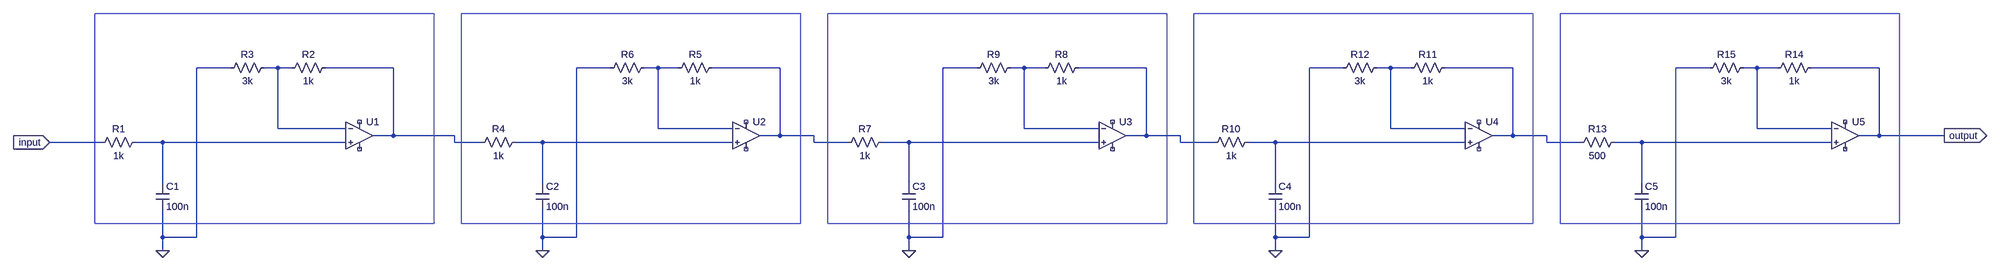
[diagram p0: schematic levy-delay.asc]
levy-delay.asc, the LTspice schematic file:
Version 4
SHEET 1 2968 1204
WIRE -1296 752 -1376 752
WIRE -1184 752 -1216 752
WIRE -1152 752 -1184 752
WIRE -912 752 -1072 752
WIRE -400 752 -480 752
WIRE -288 752 -320 752
WIRE -240 752 -288 752
WIRE 0 752 -160 752
WIRE 464 752 384 752
WIRE 576 752 544 752
WIRE 624 752 576 752
WIRE 864 752 704 752
WIRE 1328 752 1248 752
WIRE 1440 752 1408 752
WIRE 1488 752 1440 752
WIRE 1728 752 1568 752
WIRE 2192 752 2112 752
WIRE 2304 752 2272 752
WIRE 2352 752 2304 752
WIRE 2592 752 2432 752
WIRE -1184 896 -1184 752
WIRE -1024 896 -1184 896
WIRE -288 896 -288 752
WIRE -112 896 -288 896
WIRE 576 896 576 752
WIRE 752 896 576 896
WIRE 1440 896 1440 752
WIRE 1616 896 1440 896
WIRE 2304 896 2304 752
WIRE 2480 896 2304 896
WIRE -912 912 -912 752
WIRE -912 912 -960 912
WIRE -768 912 -912 912
WIRE 0 912 0 752
WIRE 0 912 -48 912
WIRE 80 912 0 912
WIRE 864 912 864 752
WIRE 864 912 816 912
WIRE 944 912 864 912
WIRE 1728 912 1728 752
WIRE 1728 912 1680 912
WIRE 1808 912 1728 912
WIRE 2592 912 2592 752
WIRE 2592 912 2544 912
WIRE 2832 912 2592 912
WIRE -1600 928 -1776 928
WIRE -1456 928 -1520 928
WIRE -1024 928 -1456 928
WIRE -768 928 -768 912
WIRE -704 928 -768 928
WIRE -560 928 -624 928
WIRE -112 928 -560 928
WIRE 80 928 80 912
WIRE 160 928 80 928
WIRE 304 928 240 928
WIRE 752 928 304 928
WIRE 944 928 944 912
WIRE 1024 928 944 928
WIRE 1168 928 1104 928
WIRE 1616 928 1168 928
WIRE 1808 928 1808 912
WIRE 1888 928 1808 928
WIRE 2032 928 1968 928
WIRE 2480 928 2032 928
WIRE -1456 1024 -1456 928
WIRE -560 1024 -560 928
WIRE 304 1024 304 928
WIRE 1168 1024 1168 928
WIRE 2032 1024 2032 928
WIRE -1456 1152 -1456 1088
WIRE -1376 1152 -1376 752
WIRE -1376 1152 -1456 1152
WIRE -560 1152 -560 1088
WIRE -480 1152 -480 752
WIRE -480 1152 -560 1152
WIRE 304 1152 304 1088
WIRE 384 1152 384 752
WIRE 384 1152 304 1152
WIRE 1168 1152 1168 1088
WIRE 1248 1152 1248 752
WIRE 1248 1152 1168 1152
WIRE 2032 1152 2032 1088
WIRE 2112 1152 2112 752
WIRE 2112 1152 2032 1152
WIRE -1456 1184 -1456 1152
WIRE -560 1184 -560 1152
WIRE 304 1184 304 1152
WIRE 1168 1184 1168 1152
WIRE 2032 1184 2032 1152
FLAG -1456 1184 0
FLAG -560 1184 0
FLAG 304 1184 0
FLAG 1168 1184 0
FLAG 2032 1184 0
FLAG -1776 928 input
IOPIN -1776 928 In
FLAG 2832 912 output
IOPIN 2832 912 Out
SYMBOL res -1504 912 R90
WINDOW 0 0 56 VBottom 2
WINDOW 3 32 56 VTop 2
SYMATTR InstName R1
SYMATTR Value 1k
SYMATTR SpiceLine tol=1 pwr=0.1
SYMBOL cap -1472 1024 R0
SYMATTR InstName C1
SYMATTR Value 100n
SYMBOL res -1056 736 R90
WINDOW 0 0 56 VBottom 2
WINDOW 3 32 56 VTop 2
SYMATTR InstName R2
SYMATTR Value 1k
SYMBOL res -1200 736 R90
WINDOW 0 0 56 VBottom 2
WINDOW 3 32 56 VTop 2
SYMATTR InstName R3
SYMATTR Value 3k
SYMBOL OpAmps\\UniversalOpAmp1 -992 912 R0
SYMATTR InstName U1
SYMBOL res -608 912 R90
WINDOW 0 0 56 VBottom 2
WINDOW 3 32 56 VTop 2
SYMATTR InstName R4
SYMATTR Value 1k
SYMATTR SpiceLine tol=1 pwr=0.1
SYMBOL cap -576 1024 R0
SYMATTR InstName C2
SYMATTR Value 100n
SYMBOL res -144 736 R90
WINDOW 0 0 56 VBottom 2
WINDOW 3 32 56 VTop 2
SYMATTR InstName R5
SYMATTR Value 1k
SYMBOL res -304 736 R90
WINDOW 0 0 56 VBottom 2
WINDOW 3 32 56 VTop 2
SYMATTR InstName R6
SYMATTR Value 3k
SYMBOL OpAmps\\UniversalOpAmp1 -80 912 R0
SYMATTR InstName U2
SYMBOL res 256 912 R90
WINDOW 0 0 56 VBottom 2
WINDOW 3 32 56 VTop 2
SYMATTR InstName R7
SYMATTR Value 1k
SYMATTR SpiceLine tol=1 pwr=0.1
SYMBOL cap 288 1024 R0
SYMATTR InstName C3
SYMATTR Value 100n
SYMBOL res 720 736 R90
WINDOW 0 0 56 VBottom 2
WINDOW 3 32 56 VTop 2
SYMATTR InstName R8
SYMATTR Value 1k
SYMBOL res 560 736 R90
WINDOW 0 0 56 VBottom 2
WINDOW 3 32 56 VTop 2
SYMATTR InstName R9
SYMATTR Value 3k
SYMBOL OpAmps\\UniversalOpAmp1 784 912 R0
SYMATTR InstName U3
SYMBOL res 1120 912 R90
WINDOW 0 0 56 VBottom 2
WINDOW 3 32 56 VTop 2
SYMATTR InstName R10
SYMATTR Value 1k
SYMATTR SpiceLine tol=1 pwr=0.1
SYMBOL cap 1152 1024 R0
SYMATTR InstName C4
SYMATTR Value 100n
SYMBOL res 1584 736 R90
WINDOW 0 0 56 VBottom 2
WINDOW 3 32 56 VTop 2
SYMATTR InstName R11
SYMATTR Value 1k
SYMBOL res 1424 736 R90
WINDOW 0 0 56 VBottom 2
WINDOW 3 32 56 VTop 2
SYMATTR InstName R12
SYMATTR Value 3k
SYMBOL OpAmps\\UniversalOpAmp1 1648 912 R0
SYMATTR InstName U4
SYMBOL res 1984 912 R90
WINDOW 0 0 56 VBottom 2
WINDOW 3 32 56 VTop 2
SYMATTR InstName R13
SYMATTR Value 500
SYMATTR SpiceLine tol=1 pwr=0.1
SYMBOL cap 2016 1024 R0
SYMATTR InstName C5
SYMATTR Value 100n
SYMBOL res 2448 736 R90
WINDOW 0 0 56 VBottom 2
WINDOW 3 32 56 VTop 2
SYMATTR InstName R14
SYMATTR Value 1k
SYMBOL res 2288 736 R90
WINDOW 0 0 56 VBottom 2
WINDOW 3 32 56 VTop 2
SYMATTR InstName R15
SYMATTR Value 3k
SYMBOL OpAmps\\UniversalOpAmp1 2512 912 R0
SYMATTR InstName U5
RECTANGLE Normal -816 1120 -1616 624
RECTANGLE Normal 48 1120 -752 624
RECTANGLE Normal 912 1120 112 624
RECTANGLE Normal 1776 1120 976 624
RECTANGLE Normal 2640 1120 1840 624

The netlist it stands for:
* levy-delay.asc
R1 N010 input 1k tol=1 pwr=0.1
C1 N010 0 100n
R2 N002 N001 1k
R3 N001 0 3k
XU1 N010 N001 NC_01 NC_02 N002 level1 Avol=1Meg GBW=10Meg Vos=0 En=0 Enk=0 In=0 Ink=0 Rin=500Meg  ; pins In+ In- V+ V- OUT
R4 N011 N002 1k tol=1 pwr=0.1
C2 N011 0 100n
R5 N004 N003 1k
R6 N003 0 3k
XU2 N011 N003 NC_03 NC_04 N004 level1 Avol=1Meg GBW=10Meg Vos=0 En=0 Enk=0 In=0 Ink=0 Rin=500Meg  ; pins In+ In- V+ V- OUT
R7 N012 N004 1k tol=1 pwr=0.1
C3 N012 0 100n
R8 N006 N005 1k
R9 N005 0 3k
XU3 N012 N005 NC_05 NC_06 N006 level1 Avol=1Meg GBW=10Meg Vos=0 En=0 Enk=0 In=0 Ink=0 Rin=500Meg  ; pins In+ In- V+ V- OUT
R10 N013 N006 1k tol=1 pwr=0.1
C4 N013 0 100n
R11 N008 N007 1k
R12 N007 0 3k
XU4 N013 N007 NC_07 NC_08 N008 level1 Avol=1Meg GBW=10Meg Vos=0 En=0 Enk=0 In=0 Ink=0 Rin=500Meg  ; pins In+ In- V+ V- OUT
R13 N014 N008 500 tol=1 pwr=0.1
C5 N014 0 100n
R14 output N009 1k
R15 N009 0 3k
XU5 N014 N009 NC_09 NC_10 output level1 Avol=1Meg GBW=10Meg Vos=0 En=0 Enk=0 In=0 Ink=0 Rin=500Meg  ; pins In+ In- V+ V- OUT
.lib UniversalOpAmp1.lib
.backanno
.end